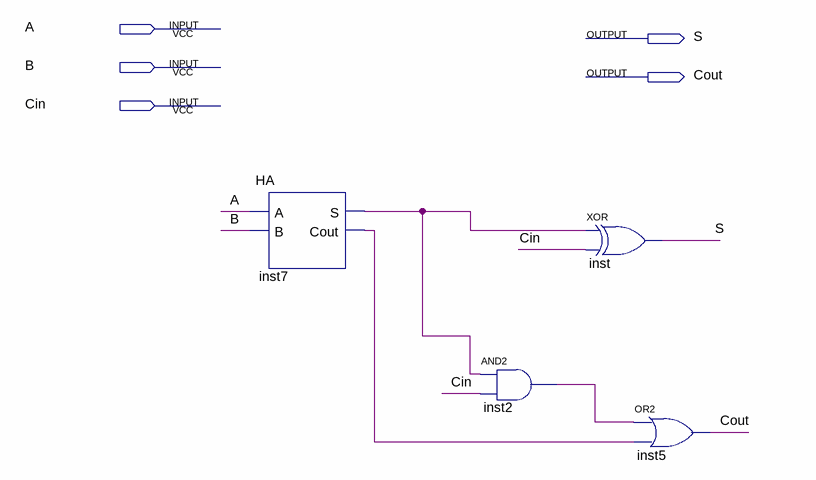
[diagram p0: schematic sheet]
// Quartus schematic FA.bdf as structural Verilog: 4 symbols, 5 pins
module FA (
  input  A,
  input  B,
  input  Cin,
  output S,
  output Cout
);

  wire inst2_out, inst7_cout, inst7_s;

  HA inst7 (.A(A), .B(B), .S(inst7_s), .Cout(inst7_cout));
  and inst2 (inst2_out, inst7_s, Cin);
  xor inst (S, inst7_s, Cin);
  or inst5 (Cout, inst2_out, inst7_cout);
endmodule
